# EAGLE design ddrive-esp-deadrail-1-4 (EAGLE 7.5.0)
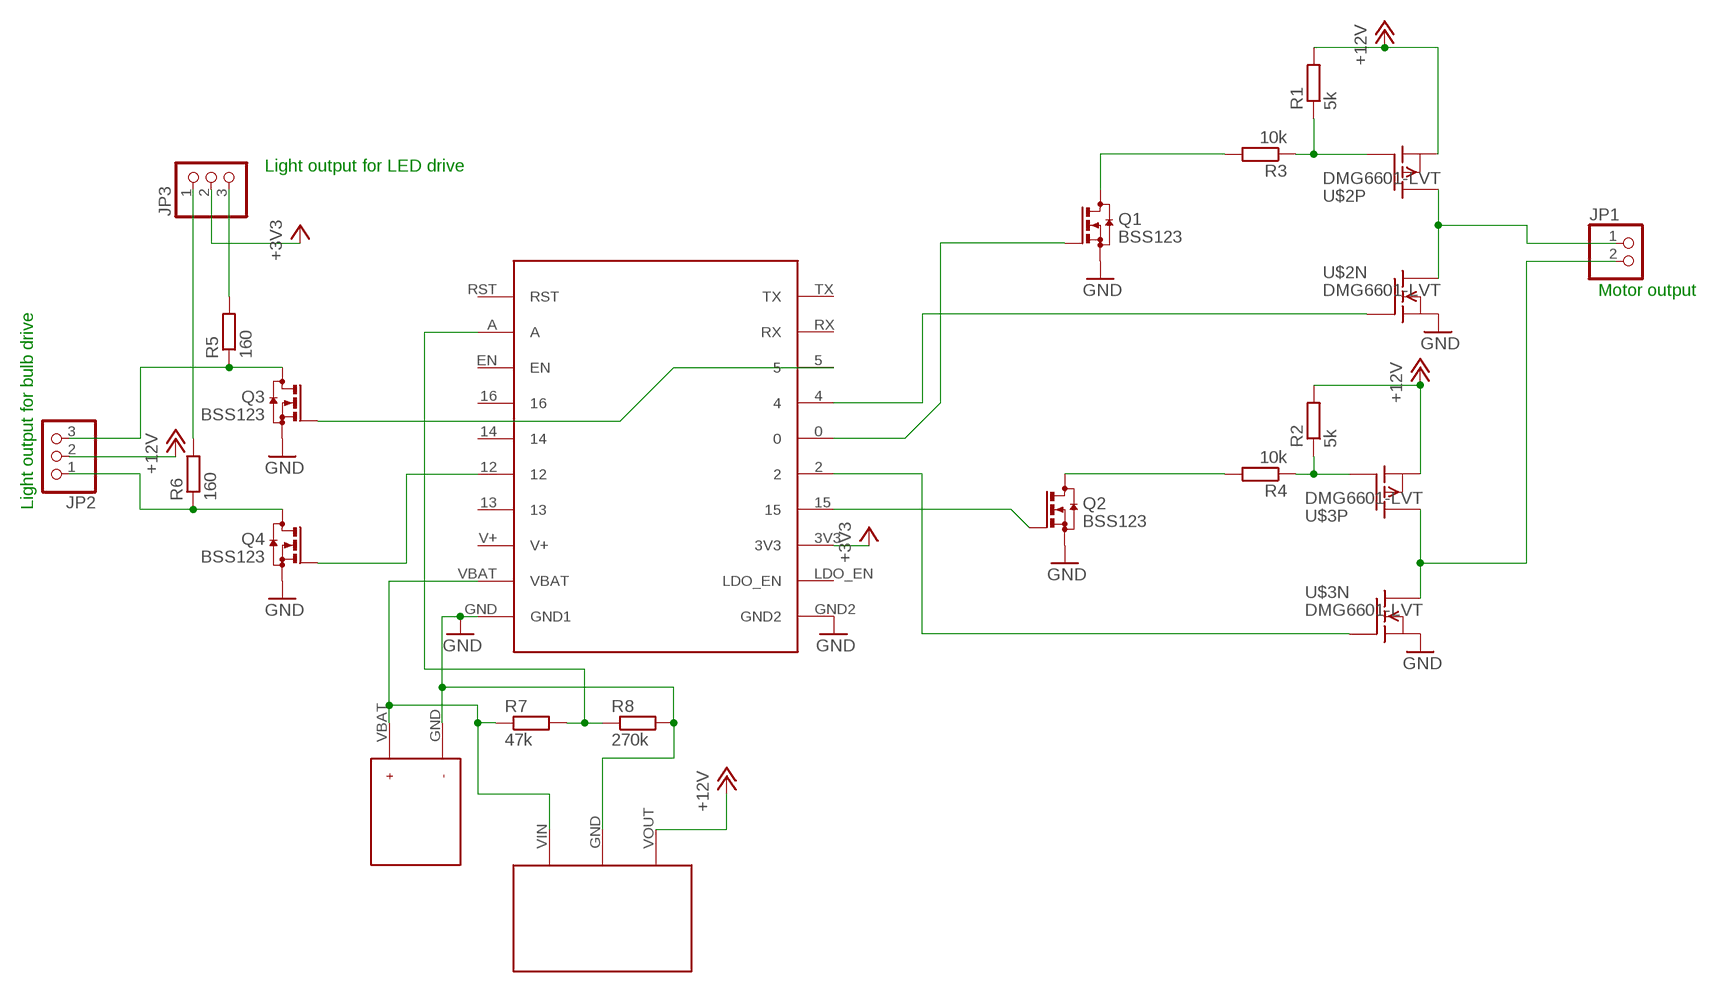
[diagram p0: schematic, sheet 1]

## Parts
JP1  PINHD-1X2  [1X02]
JP2  PINHD-1X3  [1X03]
JP3  PINHD-1X3  [1X03]
Q1  BSS123  [SOT23]
Q2  BSS123  [SOT23]
Q3  BSS123  [SOT23]
Q4  BSS123  [SOT23]
R1  5k  R-EU_R0805  [R0805]
R2  5k  R-EU_R0805  [R0805]
R3  10k  R-EU_R0805  [R0805]
R4  10k  R-EU_R0805  [R0805]
R5  160  R-EU_R0805  [R0805]
R6  160  R-EU_R0805  [R0805]
R7  47k  R-EU_R0805  [R0805]
R8  270k  R-EU_R0805  [R0805]
U$1  ESP12-HUZZAH  [ESP12-HUZZAH]
U$2  DMG6601-LVT  [TSOT-26]
U$3  DMG6601-LVT  [TSOT-26]
U$4  JST-PINHD  [JST-PINHDR]
U$5  POLOLU-VREG12  [POLOLU-REGULATOR]

## Nets
+3V3: JP3.2 U$1.3V3
+12V: JP2.2 R1.2 R2.2 U$2.2(P:S) U$3.2(P:S) U$5.VOUT
GND: Q1.2(S) Q2.2(S) Q3.2(S) Q4.2(S) R8.2 U$1.GND2 U$1.GND(GND1) U$2.5(N:S) U$3.5(N:S) U$4.GND U$5.GND
N$1: JP1.1 U$2.4(P:D) U$2.6(N:D)
N$2: R1.1 R3.1 U$2.3(P:G)
N$3: Q2.3(D) R4.2
N$4: R2.1 R4.1 U$3.3(P:G)
N$5: Q1.1(G) U$1.0
N$6: Q1.3(D) R3.2
N$7: JP1.2 U$3.4(P:D) U$3.6(N:D)
N$8: U$1.4 U$2.1(N:G)
N$9: Q2.1(G) U$1.15
N$10: U$1.2 U$3.1(N:G)
N$11: Q3.1(G) U$1.5
N$12: Q4.1(G) U$1.12
N$13: JP2.3 Q3.3(D) R5.1
N$14: JP2.1 Q4.3(D) R6.1
N$15: JP3.3 R5.2
N$16: JP3.1 R6.2
N$19: R7.2 R8.1 U$1.A
VBAT: R7.1 U$1.VBAT U$4.VBAT U$5.VIN
Unconnected: U$1.13 U$1.14 U$1.16 U$1.EN U$1.LDO_EN U$1.RST U$1.RX U$1.TX

## Notes on the sheet
- Light output for LED drive
- Motor output
- Light output for bulb drive

## Power pins joined to a net without a drawn wire
V+: U$1.V+

## Library data of the parts
JP1 = pinhead:PINHD-1X2: PIN HEADER
JP2 JP3 = pinhead:PINHD-1X3: PIN HEADER
Q1-Q4 = transistor-small-signal:BSS123: N-CHANNEL MOS FET
R1-R8 = rcl:R-EU_: RESISTOR, European symbol
U$1 = trainlib:ESP12-HUZZAH
U$2 U$3 = trainlib:DMG6601-LVT: Dual N+P-channel MOSFET. Package: TSOT-26 Vmax=30V N-channel: 55mOhm, 3.8A Imax P-channel: 110mOhm, 2.5A Imax
U$4 = trainlib:JST-PINHD
U$5 = trainlib:POLOLU-VREG12

## Board
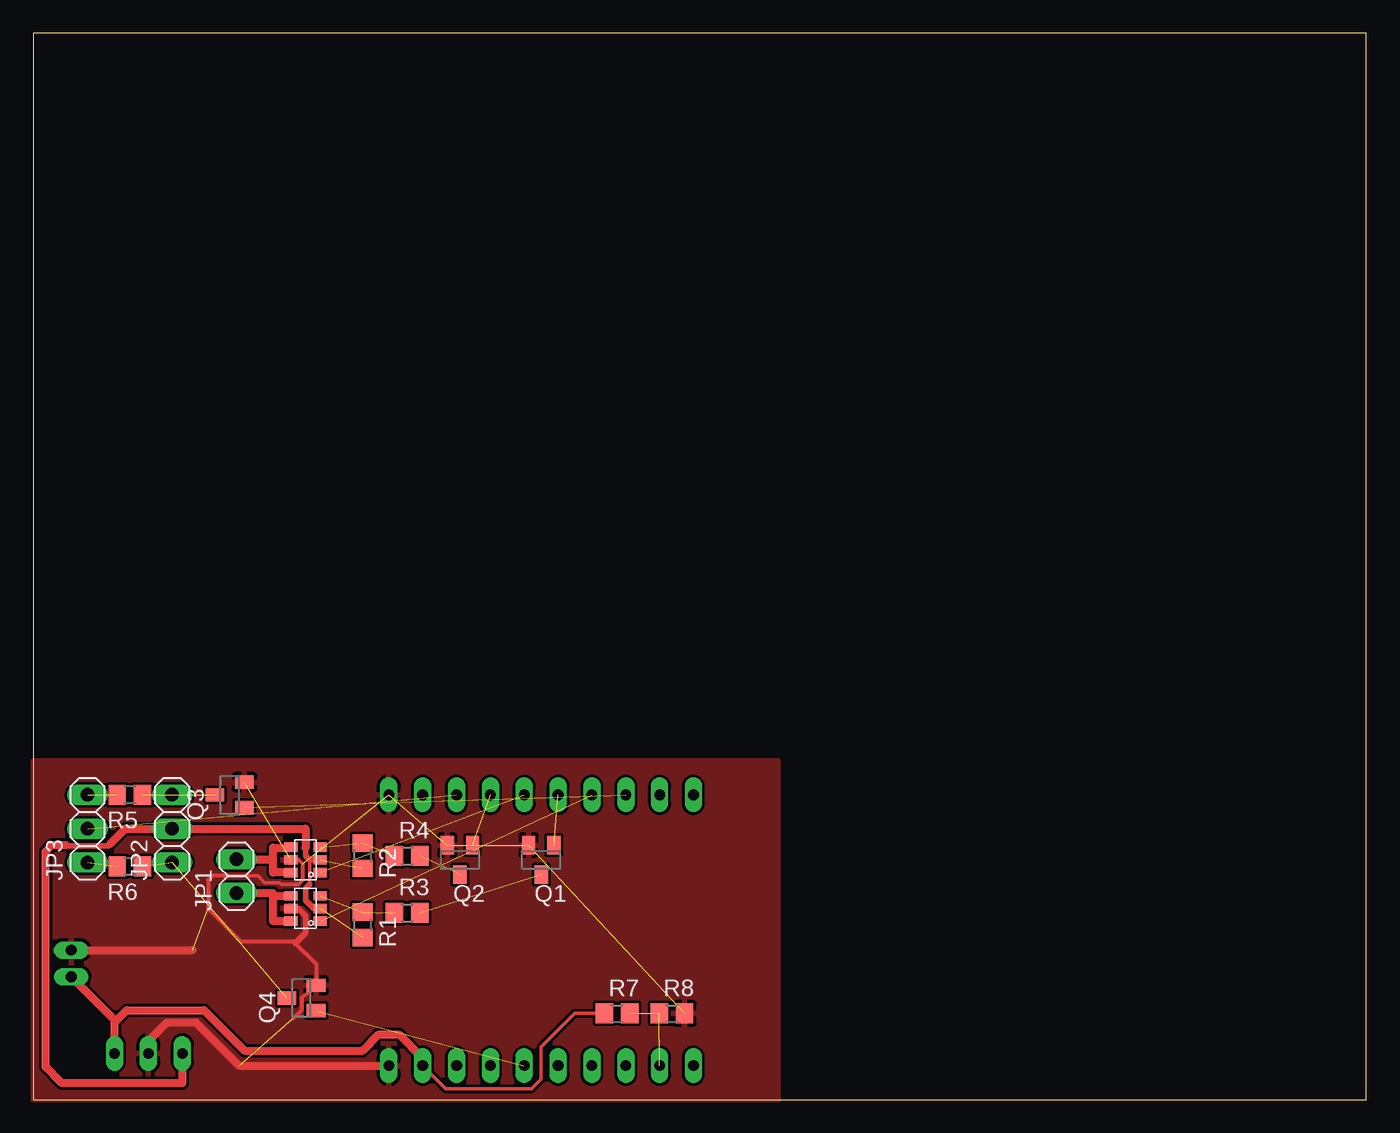
[diagram p1: board, top side]
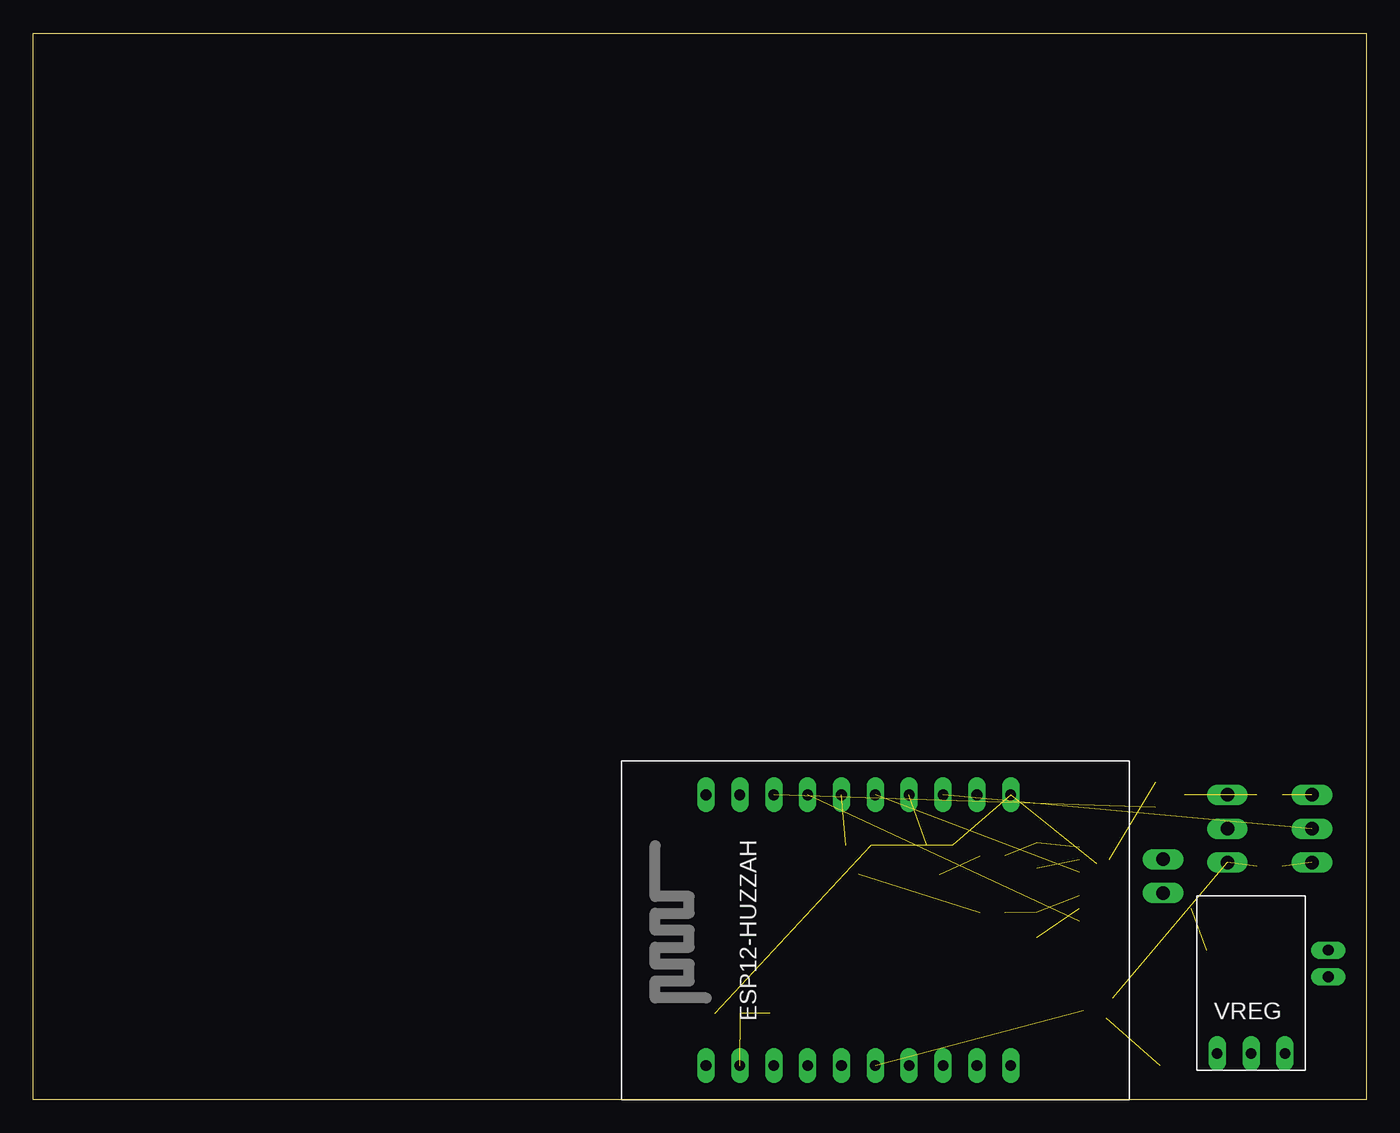
[diagram p2: board, bottom side, seen from below]

Size 100 x 80 mm. Coordinates in mm from the lower left corner, seen from the top.
Outline: 0,0 100,0 100,80 0,80 0,0
Copper layers (1*16): Top 0.035mm / dielectric 1.5mm / Bottom 0.035mm
Design rules "self-etch": minimum track width 8mil, minimum drill 24mil, track to track 8mil, track to pad 8mil, pad to pad 8mil, via to via 8mil, smd to smd 0mil, copper to edge 0mil, drill to drill 8mil, minimum pad ring 10mil, minimum via ring 8mil, stop-mask expansion 4mil, vias tented up to drill 0mil, thermal gap 10mil

### Footprints (pad centres in the part's own frame; a part is rotated, then mirrored left to right if it is on the bottom)
1X02 = drill 1.016 long: 1 -1.27,0; 2 1.27,0
1X03 = drill 1.016 long: 1 -2.54,0; 2 0,0; 3 2.54,0
SOT23 = smd 1 x 1.4: 1 -0.95,-1.1; 2 0.95,-1.1; 3 0,1.1
R0805 = smd 1.3 x 1.5: 1 -0.95,0; 2 0.95,0
ESP12-HUZZAH = drill 0.8 long: 0 10.16,2.54; 2 10.16,0; 3V3 10.16,-5.08; 4 10.16,5.08; 5 10.16,7.62; 12 -10.16,0; 13 -10.16,-2.54; 14 -10.16,2.54; 15 10.16,-2.54; 16 -10.16,5.08; A -10.16,10.16; EN -10.16,7.62; GND -10.16,-10.16; GND2 10.16,-10.16; LDO_EN 10.16,-7.62; RST -10.16,12.7; RX 10.16,10.16; TX 10.16,12.7; V+ -10.16,-5.08; VBAT -10.16,-7.62
TSOT-26 = smd 0.7 x 1: 1 -0.95,-1.1; 2 0,-1.1; 3 0.95,-1.1; 4 0.95,1.1; 5 0,1.1; 6 -0.95,1.1
JST-PINHDR = drill 0.8 long: GND -1,0; VBAT 1,0
POLOLU-REGULATOR = drill 0.8 long: GND 4.064,1.27; VIN 6.604,1.27; VOUT 1.524,1.27

### Placement (x,y rotation side)
JP1  15.24,16.76 90 top
JP2  10.41,20.32 90 top
JP3  4.06,20.32 90 top
Q1  38.1,17.98 180 top
Q2  32,17.98 180 top
Q3  14.73,22.86 90 top
Q4  20.12,7.62 90 top
R1  24.69,13.11 270 top
R2  24.69,18.29 270 top
R3  28.04,14.02 0 top
R4  28.04,18.29 0 top
R5  7.24,22.86 180 top
R6  7.24,17.48 180 top
R7  43.79,6.45 0 top
R8  47.9,6.45 0 top
U$1  36.83,12.7 90 bottom
U$2  20.42,14.33 90 top
U$3  20.42,17.98 90 top
U$4  2.84,10.21 270 top
U$5  12.7,2.18 0 bottom

### Tracks (layer width: path | path; a pad name or v marks a point on that pad's centre or on a via)
+3V3  (1 unrouted)
+12V  (2 unrouted)
  Top 0.254: 20.73,17.98 20.73,16.15 | 21.03,14.33 U$2.2
  Top 0.406: 20.42,18.9 20.42,18.29 20.73,17.98 U$3.2 | 20.73,16.15 20.42,15.85 20.42,14.94 21.03,14.33 | 2.44,19.1 2.49,19.05 5.64,19.05 5.79,19.2
  Top 0.61: 20.42,18.9 20.42,20.32 JP2.2 6.91,20.32 5.79,19.2 | U$5.VOUT 11.18,1.22 2.13,1.22 0.91,2.44 0.91,18.59 1.42,19.1 2.44,19.1
GND  (7 unrouted)
  Top 0.254: U$3.5 19.91,17.98 20.22,17.68 20.22,16.46 19.91,16.15 18.59,16.15 18.49,16.26 17.37,16.26 16.87,16.76 14.33,16.76
  Top 0.305: 14.33,16.76 13.41,16.76 13.11,16.46 13.11,14.33 15.54,11.89 19.51,11.89 19.66,11.73 21.22,10.18 Q4.2 21.38,8.53 | 21.38,8.53 21.34,8.53 | 21.38,8.53 20.12,7.62 20.12,6.71 19.51,6.1
  Top 0.406: U$2.5 19.86,14.33 20.42,13.77 20.42,12.5 19.66,11.73
  Top 0.61: U$4.GND 11.95,11.21 | U$5.GND 8.64,4.37 10.06,5.79 12.19,5.79 15.44,2.54 U$1.GND
  pour Top: 0,25.4 55.88,25.4 55.88,0 0,0
N$1
  Top 0.61: U$2.6 17.98,13.38 17.98,15.28 | 17.98,15.28 U$2.4 | JP1.1 17.98,15.49 17.98,15.28
N$2  (2 unrouted)
N$3  (1 unrouted)
N$4  (2 unrouted)
N$5  (1 unrouted)
N$6  (1 unrouted)
N$7
  Top 0.61: U$3.6 17.98,17.03 17.98,17.98 17.98,18.03 | 17.98,18.03 17.98,18.9 19.32,18.9 U$3.4 | JP1.2 17.98,18.03
N$8  (1 unrouted)
N$9  (1 unrouted)
N$10  (1 unrouted)
N$11  (1 unrouted)
N$12  (1 unrouted)
N$13  (2 unrouted)
N$14  (2 unrouted)
N$15  (1 unrouted)
N$16  (1 unrouted)
N$19  (2 unrouted)
VBAT
  Top 0.254: U$1.VBAT 30.94,0.81 37.39,0.81 38.1,1.52 38.1,3.96 40.59,6.45 R7.1
  Top 0.61: U$4.VBAT 6.1,5.96 6.1,5.79 | U$5.VIN 6.1,5.79 | 6.1,5.79 7.01,6.71 12.8,6.71 15.85,3.66 24.69,3.66 25.91,4.88 27.43,4.88 29.21,3.1 U$1.VBAT